# Altium schematic sheet arte_sensor.SchDoc
size A4
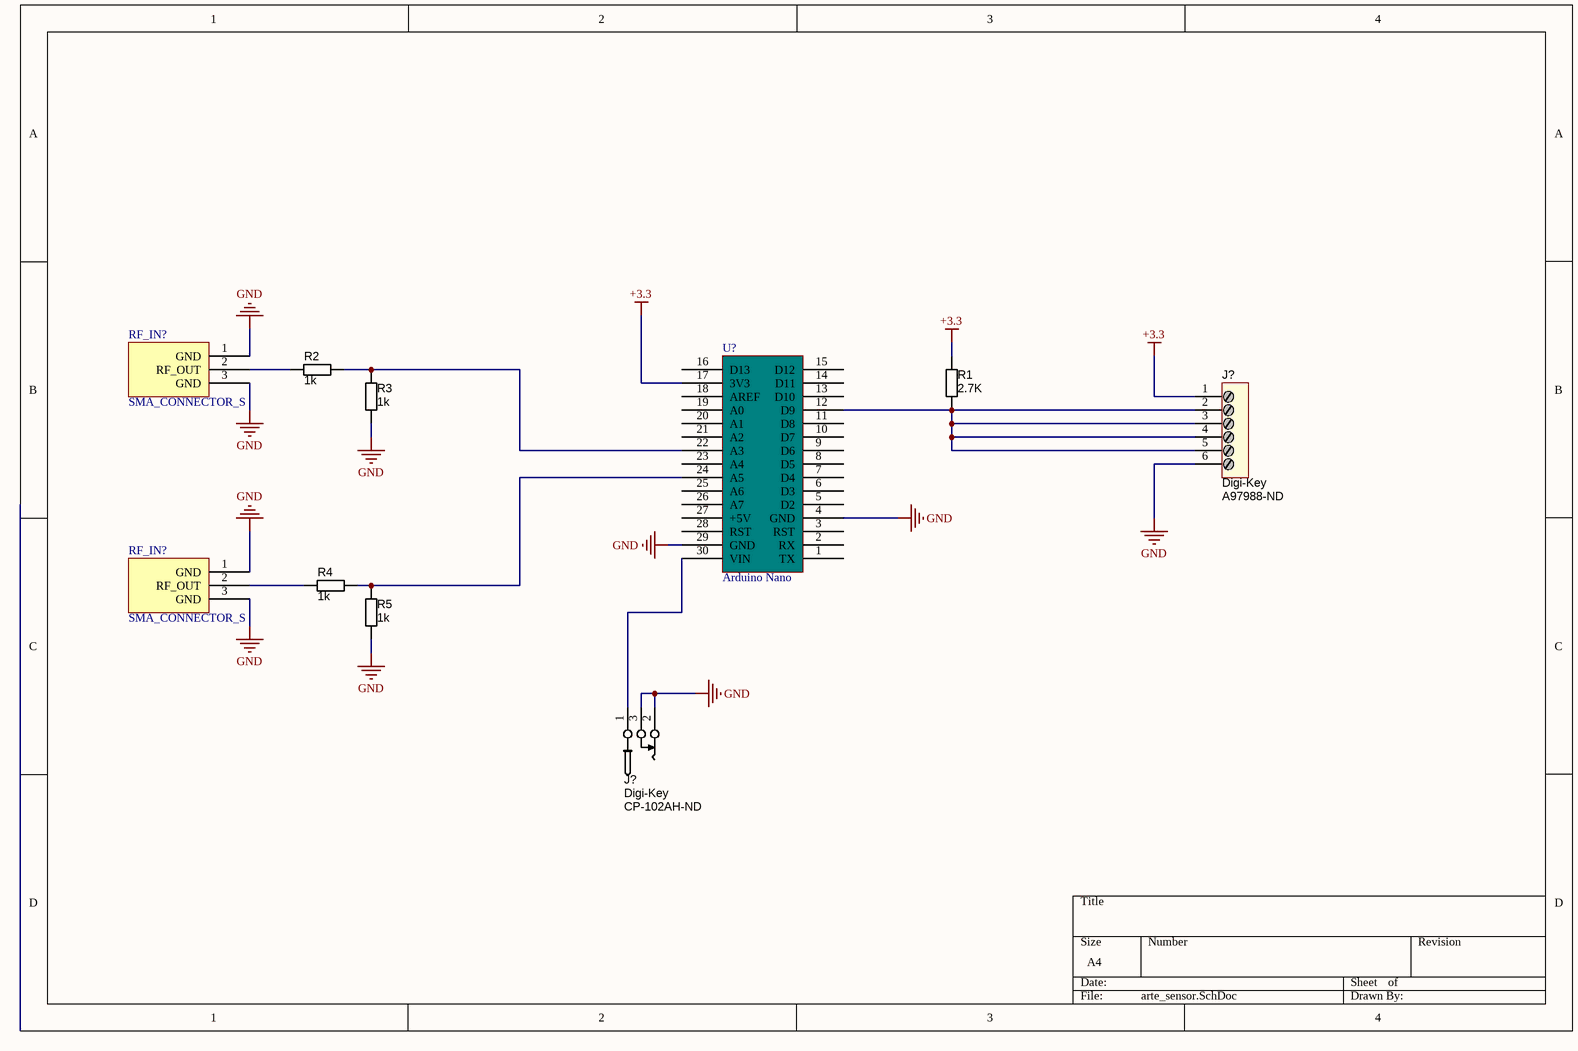
[diagram p0: arte_sensor.SchDoc]

## Parts
(Parts that share a designator on the sheet are numbered #1, #2 ... from top to bottom, then left to right.)
J?#1  Supplier 1: Digi-Key  Supplier Part Number 1: A97988-ND  [6P_PCB_ScrewTerm90S]  (hidden comment: 6P_ScrewTerm_90S)
J?#2  Supplier 1: Digi-Key  Supplier Part Number 1: CP-102AH-ND  [CONN_PWR_JACK_2.1x5.5mm]  (hidden comment: CONN_PWR_JACK_2.1x5.5mm)
R1  value 2.7K  [RESTH_AXIAL-0.4]  (hidden comment: Carbon Film)
R2  value 1k  [RESTH_AXIAL-0.4]  (hidden comment: Carbon Film)
R3  value 1k  [RESTH_AXIAL-0.4]  (hidden comment: Carbon Film)
R4  value 1k  [RESTH_AXIAL-0.4]  (hidden comment: Carbon Film)
R5  value 1k  [RESTH_AXIAL-0.4]  (hidden comment: Carbon Film)
RF_IN?#1  SMA_CONNECTOR_S  [SMA_CONNECTOR]
RF_IN?#2  SMA_CONNECTOR_S  [SMA_CONNECTOR]
U?  Arduino Nano  [PCBComponent_1]

## Nets
+3.3: J?#1.1 R1.1 U?.17(3V3)
GND: J?#1.6 J?#2.2 J?#2.3 R3.2 R5.2 RF_IN?#1.1(GND) RF_IN?#1.3(GND) RF_IN?#2.1(GND) RF_IN?#2.3(GND) U?.4(GND) U?.29(GND)
NetJ?#1_2: J?#1.2 J?#1.3 J?#1.4 J?#1.5 R1.2 U?.12(D9)
NetJ?#2_1: J?#2.1 U?.30(VIN)
NetR2_1: R2.1 RF_IN?#1.2(RF_OUT)
NetR2_2: R2.2 R3.1 U?.22(A3)
NetR4_1: R4.1 RF_IN?#2.2(RF_OUT)
NetR4_2: R4.2 R5.1 U?.24(A5)

Not connected (* = marked no-connect by the designer): U? 1(TX) 2(RX) 3(RST) 5(D2) 6(D3) 7(D4) 8(D5) 9(D6) 10(D7) 11(D8) 13(D10) 14(D11) 15(D12) 16(D13) 18(AREF) 19(A0) 20(A1) 21(A2) 23(A4) 25(A6) 26(A7) 27(+5V) 28(RST)

## Library data of the parts
J?#1 = 6P_ScrewTerm_90S: TERM BLOCK 6POS SIDE ENT STACKABLE 5.08MM; Manufacturer 1: Tyco Electronics; Manufacturer Part Number 1: 1776119-6; Current: 10A; Mating Orientation: Horizontal with Board; Pitch: 0.200" (5.08mm); Voltage: 300V; Wire Gauge: 15-17 AWG; Number of Levels: 1; Positions Per Level: 6; Category: Connectors Interconnects; Color: Black; Features: -; Mounting Type: Through Hole; Terminal Block Type: Wire to Board; Termination: Screw; ComponentLink1URL: http://documents.tycoelectronics.com/commerce/DocumentDelivery/DDEController?Action=srchrtrv&DocNm=1776119&DocType=CD&DocLang=EN; ComponentLink1Description: http://documents.tycoelectronics.com/commerce/DocumentDelivery/DDEController?Action=srchrtrv&DocNm=1776119&DocType=CD&DocLang=EN; Package / Case: Side Entry; 5.08mm pitch
J?#2 = CONN_PWR_JACK_2.1x5.5mm: Power Connector, THT, 2.1mm ID, 5.5mm OD; Manufacturer 1: CUI Inc; Manufacturer Part Number 1: PJ-102AH; Category: Connectors; Mounting Type: Through Hole; Package / Case: PCB mount; Value: 2.1mm ID, 5.5mm OD
R1-R5 = RES_1K_Axial_0.25W_5%: Resistor THD Axial 1k Ohm 0.25W 5% Carbon Film; Manufacturer 1: Yageo; Manufacturer Part Number 1: CFR-25JB-1K0; Ratings: 1/4W; Tolerance: ±5%; Package / Case: Axial; Supplier 1: Digi-Key; Supplier Part Number 1: 1.0KQBK-ND
U? = Component_1